# EAGLE design Grove - MOSFET (EAGLE 6.3)
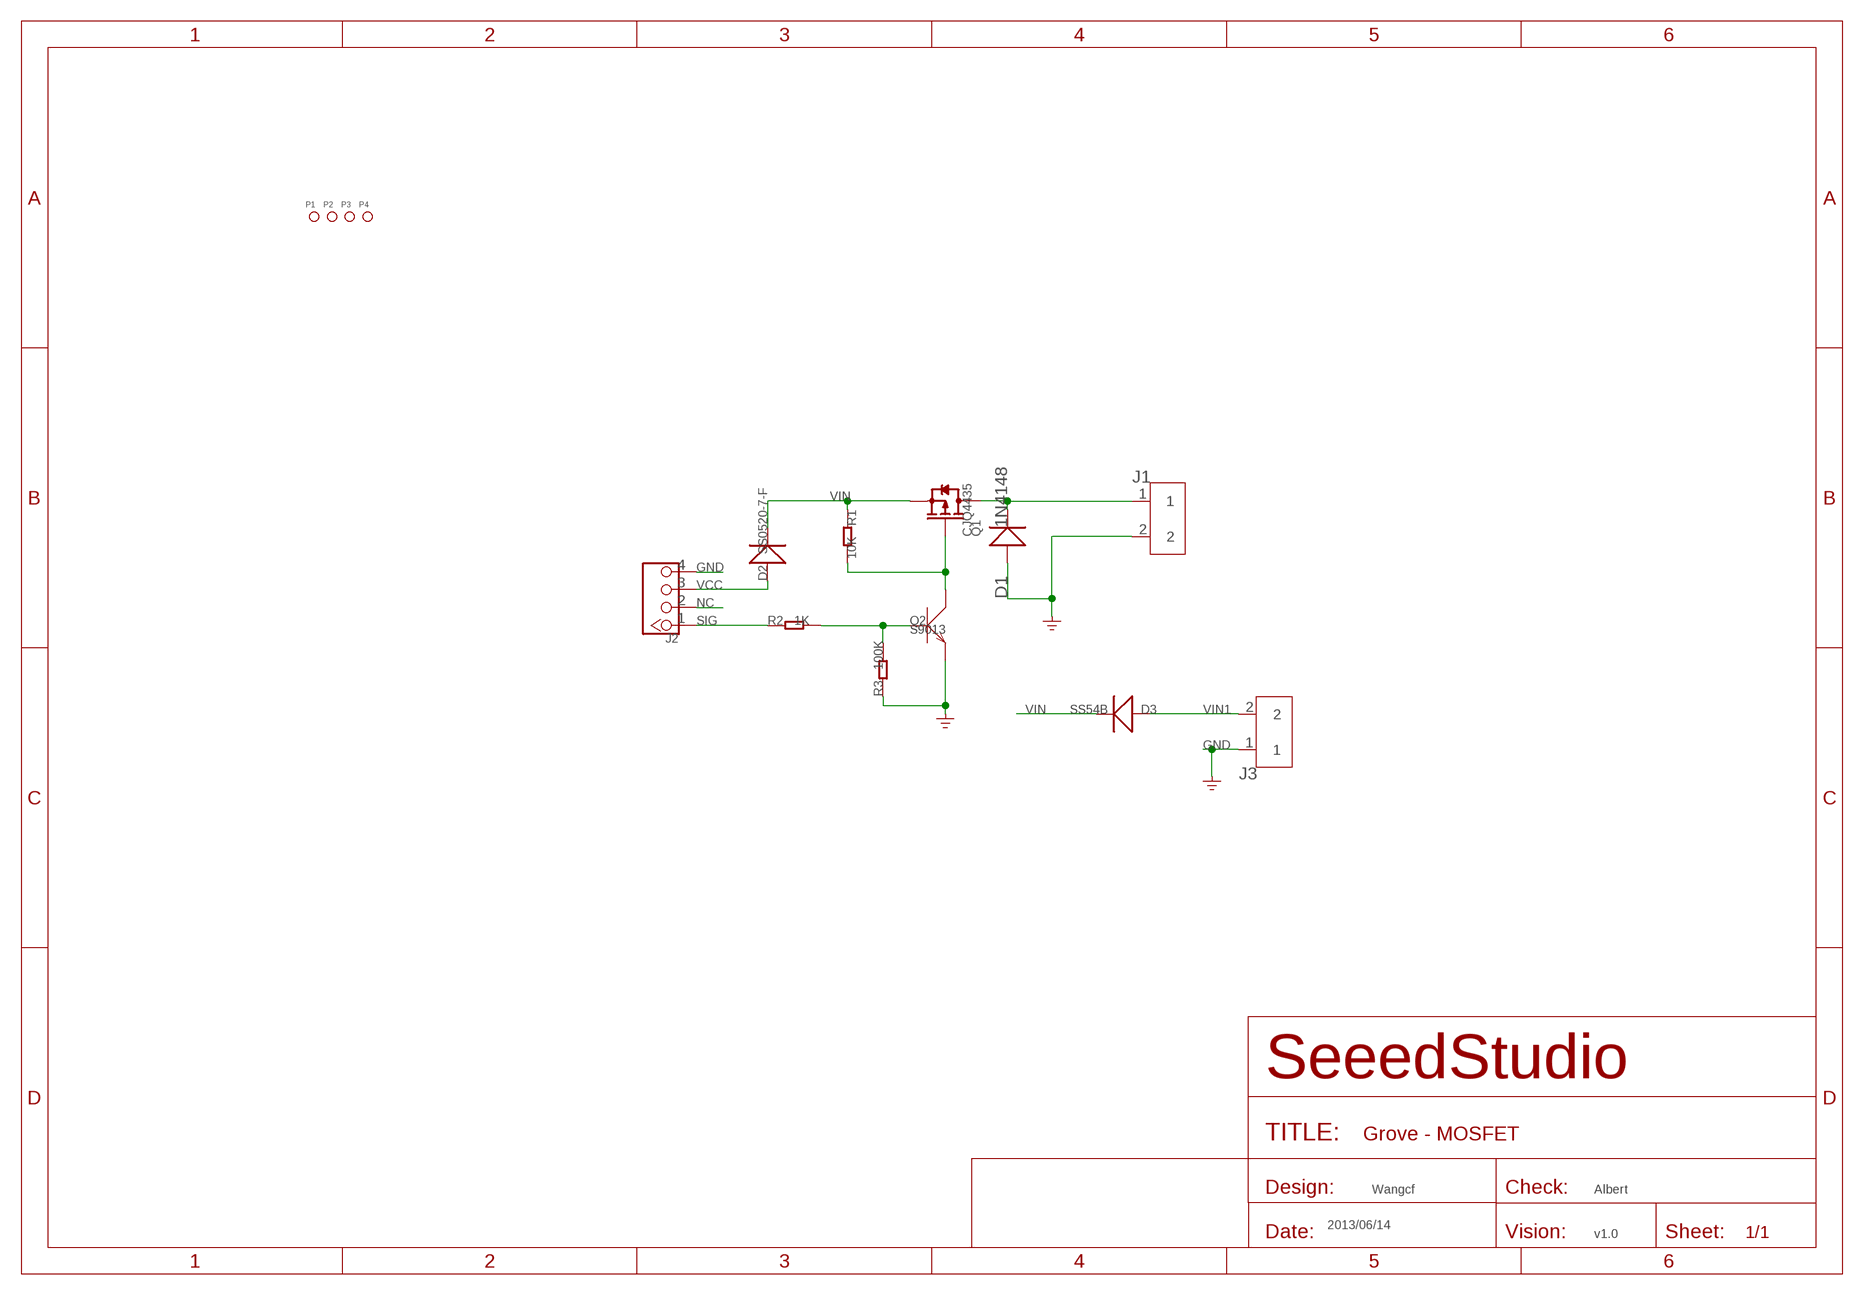
[diagram p0: schematic, sheet 1]

## Parts
D1  1N4148  D'1N4148-SMD'  [DO-35-SMD]
D2  SS0520-7-F  D'1206'  [SOD123]
D3  SS54B  D'MBRS240LT3'  [SMB]
J1  SCREW-TERMINAL-2P'5.0-10.6X10X14.8H'  [2P-5.0-10.6X10X14.8H]
J2  TWIG-4P-2.0-2.0  [4P-2.0]
J3  SCREW-TERMINAL-2P'5.0-10.6X10X14.8H'  [2P-5.0-10.6X10X14.8H]
P1  PAD-MARK  [ROUND-MARK-1.0]
P2  PAD-MARK  [ROUND-MARK-1.0]
P3  PAD-MARK  [ROUND-MARK-1.0]
P4  PAD-MARK  [ROUND-MARK-1.0]
Q1  CJQ4435  MOSFET-P'TPC8127'  [SOP8]
Q2  S9013  TRANSISTOR-NPN-SOT23  [SOT23]
R1  10K  R-0603  [R0603]
R2  1K  R-0603  [R0603]
R3  100K  R-0603  [R0603]

## Nets
GND: D1.A(+) J1.2 J2.4 J3.1 Q2.2(E) R3.1
N$1: Q2.1(B) R2.2 R3.2
N$3: D1.C(-) J1.1 Q1.5(D) Q1.6(D) Q1.7(D) Q1.8(D)
N$6: Q1.4(G) Q2.3(C) R1.2
NC: J2.2
SIG: J2.1 R2.1
VCC: D2.+ J2.3
VIN: D2.- D3.- Q1.1(S) Q1.2(S) Q1.3(S) R1.1
VIN1: D3.+ J3.2

## Notes on the sheet
- Wangcf | Albert
- 2013/06/14
- v1.0

## Library data of the parts
D1 D3 = Discrete:D*
D2 = Discrete1:D*
J1 J3 = Connector:SCREW-TERMINAL-2P
J2 = Connector:TWIG-4P-2.0
P1-P4 = Discrete:PAD-MARK; PARTNO: DNP
Q1 = Discrete1:MOSFET-P
Q2 = Discrete:TRANSISTOR-NPN*: NPN audion
R1-R3 = Discrete:R*

## Net classes
0 default: width 0.203 mm, drill 0.305 mm, clearance 0.203 mm

## Board
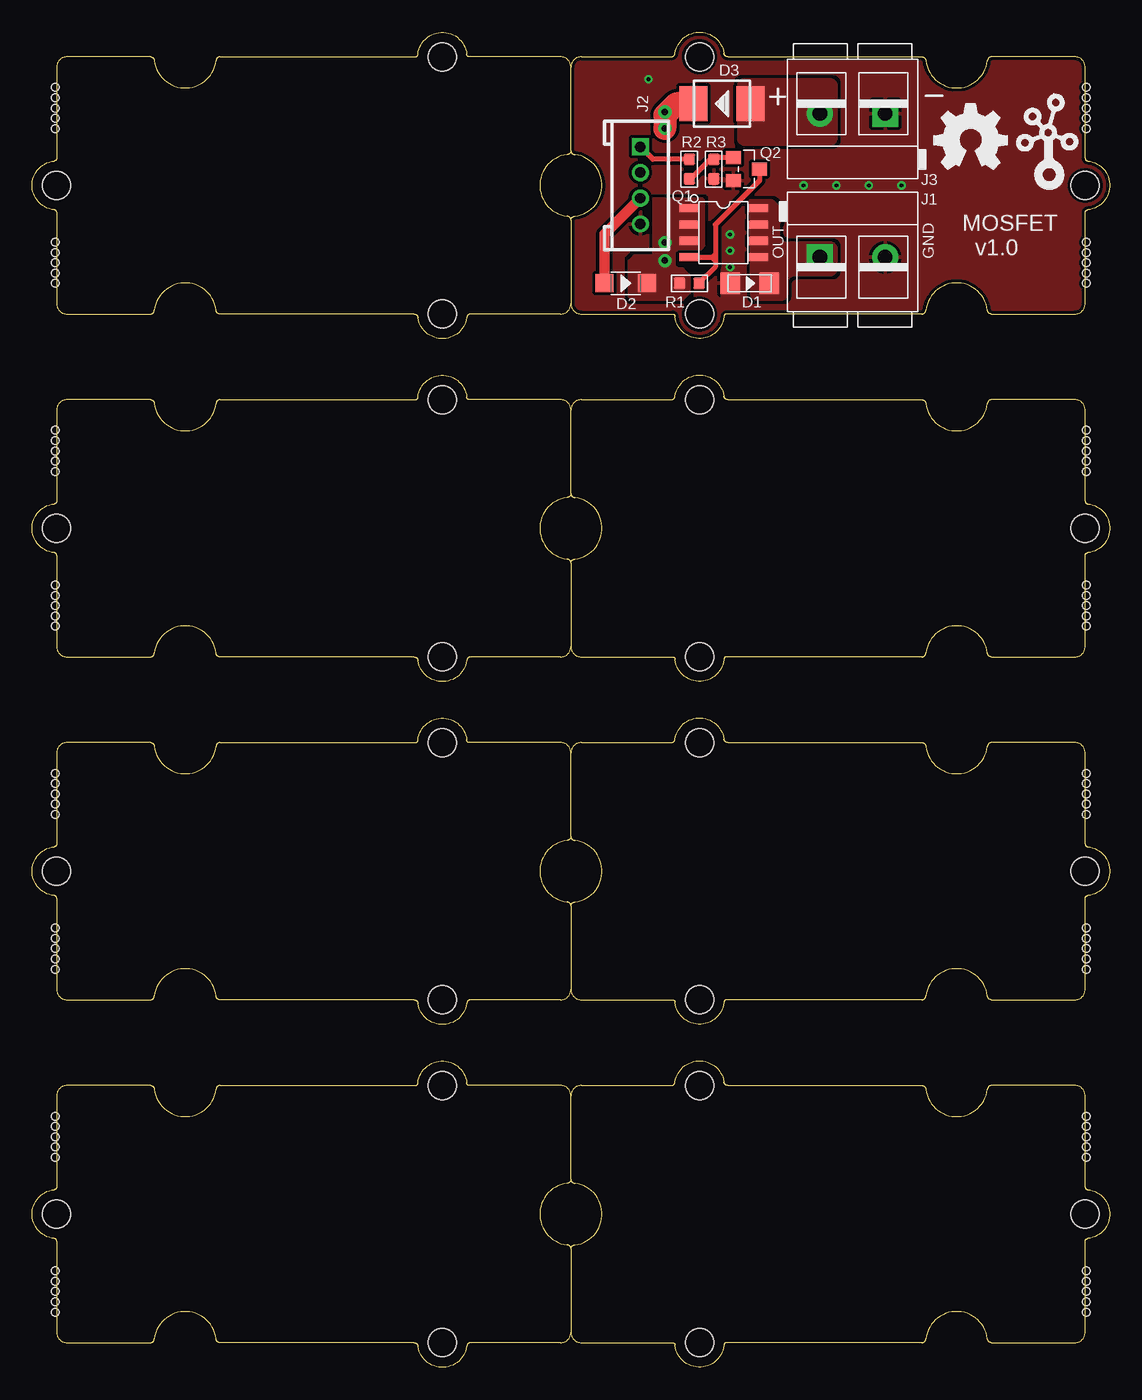
[diagram p1: board, top side]
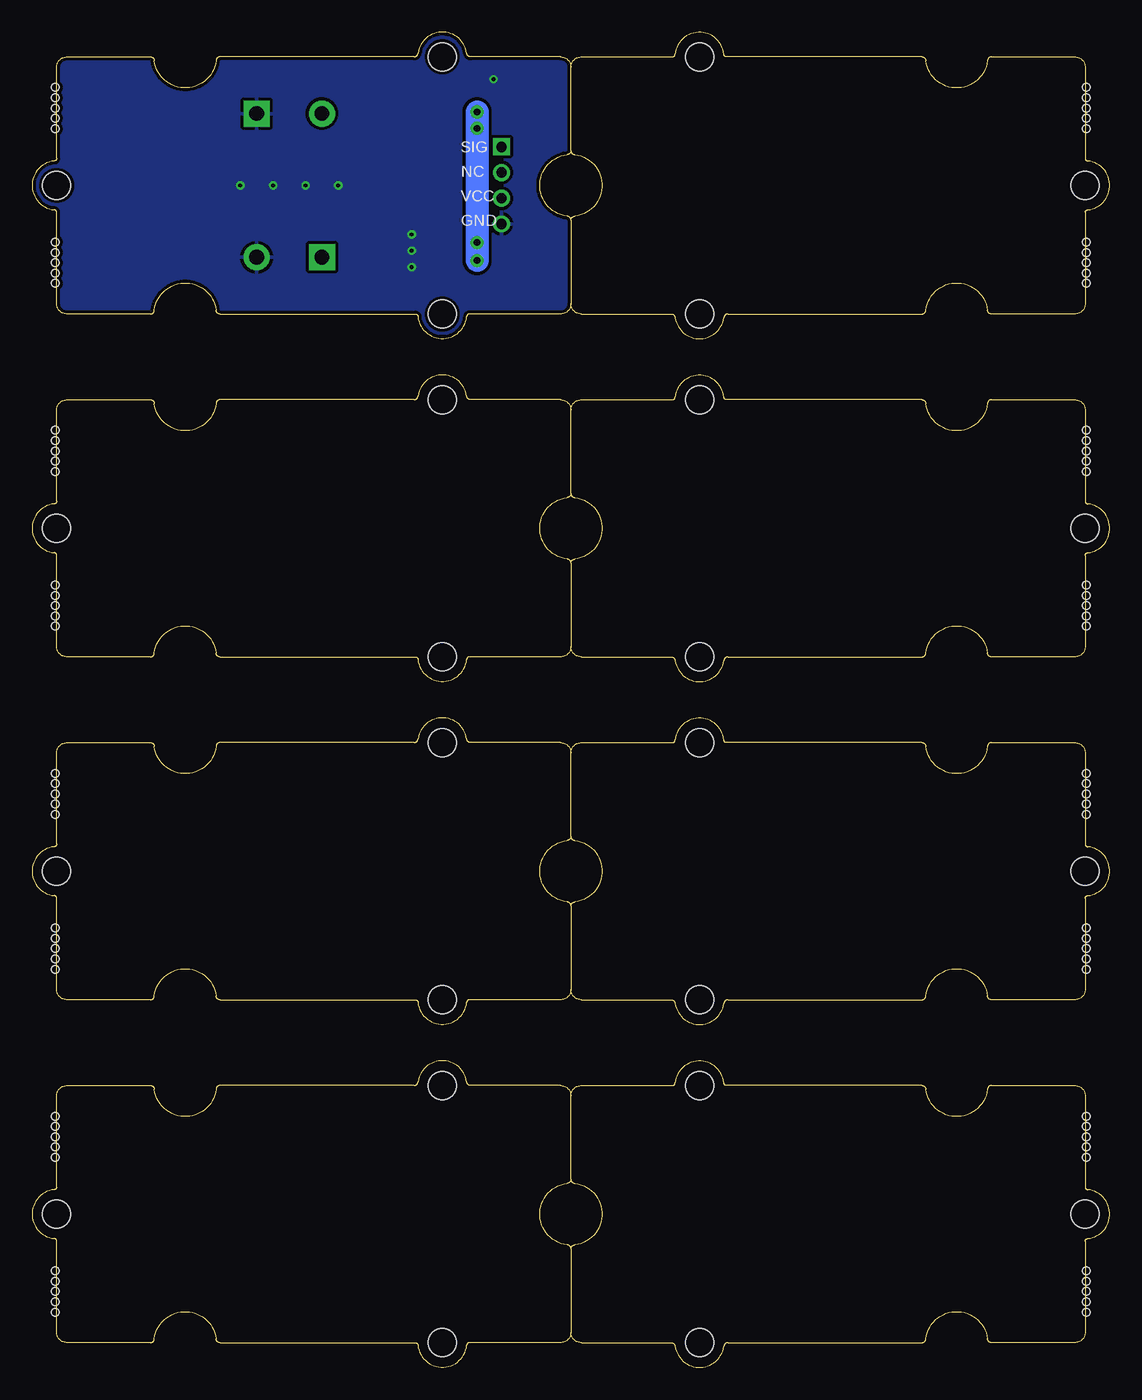
[diagram p2: board, bottom side, seen from below]

Size 83.82 x 103.85 mm. Coordinates in mm from the lower left corner, seen from the top.
Copper layers (1*16): Top 0.035mm / dielectric 1.5mm / Bottom 0.035mm
Design rules "SeeedStudio_DRU_no_angle_20130527 *": minimum track width 6mil, minimum drill 12mil, track to track 6mil, track to pad 6mil, pad to pad 6mil, via to via 6mil, smd to smd 0mil, copper to edge 10mil, drill to drill 10mil, minimum pad ring 10mil, minimum via ring 6mil, stop-mask expansion 2mil, vias tented up to drill 25mil, thermal gap 10mil
Holes 2.03 mm at -4.76,100.19 -4.76,3.67 88.58,3.67 88.58,100.19
Holes 0.6 mm at 1.81,99.55 1.81,98.75 1.81,97.95 1.81,97.15 1.81,96.35 1.81,84.31 1.81,85.11 1.81,85.91 1.81,86.71 1.81,87.51 1.81,72.88 1.81,72.08 1.81,71.28 1.81,70.48 1.81,69.68 1.81,57.64 1.81,58.44 1.81,59.24 1.81,60.04 1.81,60.84 1.81,46.21 1.81,45.41 1.81,44.61 1.81,43.81 1.81,43.01 1.81,30.97 1.81,31.77 1.81,32.57 1.81,33.37 1.81,34.17 1.81,19.54 1.81,18.74 1.81,17.94 1.81,17.14 1.81,16.34 1.81,4.3 1.81,5.1 1.81,5.9 1.81,6.7 1.81,7.5 82.01,4.3 82.01,5.1 82.01,5.9 82.01,6.7 82.01,7.5 82.01,19.54 82.01,18.74 82.01,17.94 82.01,17.14 82.01,16.34 82.01,30.97 82.01,31.77 82.01,32.57 82.01,33.37 82.01,34.17 82.01,46.21 82.01,45.41 82.01,44.61 82.01,43.81 82.01,43.01 82.01,57.64 82.01,58.44 82.01,59.24 82.01,60.04 82.01,60.84 82.01,72.88 82.01,72.08 82.01,71.28 82.01,70.48 82.01,69.68 82.01,84.31 82.01,85.11 82.01,85.91 82.01,86.71 82.01,87.51 82.01,99.55 82.01,98.75 82.01,97.95 82.01,97.15 82.01,96.35

### Footprints (pad centres in the part's own frame; a part is rotated, then mirrored left to right if it is on the bottom)
DO-35-SMD = smd 1.524 x 1.676: A -1.524,0; C 1.524,0
SOD123 = smd 1.397 x 1.397: + -1.651,0; - 1.651,0
SMB = smd 2.159 x 2.743: + -2.21,0; - 2.21,0
2P-5.0-10.6X10X14.8H = drill 1.143 pad 2.032 square: 1 -2.54,-0.508 | drill 1.143 pad 2.032: 2 2.54,-0.508
4P-2.0 = drill 0.8 pad 1.27 square: 1 -3,0 | drill 0.8 pad 1.27: 2 -1,0; 3 1,0; 4 3,0
ROUND-MARK-1.0 = smd 1.016 x 1.016: P$1 0,0
SOP8 = smd 0.635 x 1.524: 1 -1.905,-2.667; 2 -0.635,-2.667; 3 0.635,-2.667; 4 1.905,-2.667; 5 1.905,2.667; 6 0.635,2.667; 7 -0.635,2.667; 8 -1.905,2.667
SOT23 = smd 1.016 x 1.143: 1 -0.889,-1.016; 2 0.889,-1.016; 3 0,1.016
R0603 = smd 0.889 x 0.889: 1 -0.762,0; 2 0.762,0
2U-DIM-W/DRILL = hole 2.2: -10,-10; -10,10; 20,0

### Placement (x,y rotation side)
D1  55.82,84.31 0 top
D2  46.17,84.31 0 top
D3  53.66,98.28 180 top
J1  63.82,86.85 0 top
J2  47.31,91.93 270 top
J3  63.82,97.01 180 top
P1  -4.76,95.11 0 top  (outside the outline)
P2  88.58,95.11 0 top  (outside the outline)
P3  -4.76,8.75 0 top  (outside the outline)
P4  88.58,8.75 0 top  (outside the outline)
Q1  53.79,88.25 270 top
Q2  55.56,93.2 270 top
R1  51.12,84.31 0 top
R2  51.12,93.2 270 top
R3  53.02,93.2 90 top
U$5  [2U-DIM-W/DRILL]  61.91,91.93 0 top
U$6  [TWIGLOGO]  79.06,92.57 0 top
U$7  [OSHW_FILLX200_NOTEXT]  70.17,93.2 0 top
U$8  [2U-DIM-W/DRILL]  21.91,91.93 180 top
U$9  [2U-DIM-W/DRILL]  21.91,65.26 180 top
U$10  [2U-DIM-W/DRILL]  61.91,65.26 0 top
U$11  [2U-DIM-W/DRILL]  21.91,38.59 180 top
U$12  [2U-DIM-W/DRILL]  61.91,38.59 0 top
U$13  [2U-DIM-W/DRILL]  21.91,11.92 180 top
U$14  [2U-DIM-W/DRILL]  61.91,11.92 0 top

### Tracks (layer width: path | path; a pad name or v marks a point on that pad's centre or on a via)
GND  (via drill 0.3 pad 0.64)
  other vias: 47.94,100.19 54.29,88.12 60.01,91.93 62.55,91.93 65.09,91.93 67.63,91.93 54.29,86.85 54.29,85.58
  pour Bottom (isolate 0.254, rank 3): 41.59,79.87 84.14,79.87 84.14,104 41.59,104
  pour Top (isolate 0.254, rank 3): 41.59,79.87 84.14,79.87 84.14,102.09 84.14,104 41.59,104 41.59,79.99
  pour Top (isolate 0.254, no thermals): 53.66,85.58 55.44,85.58 55.44,82.66 53.66,82.66
N$1
  Top 0.406: R2.2 51.25,92.44 52.77,93.96 R3.2 | R3.2 53.15,94.09 | Q2.1 53.02,94.09 R3.2
N$3
  pour Top (isolate 0.254, no thermals): 55.82,90.79 55.94,83.55 arc90 56.45,83.04 58.23,83.04 arc90 58.74,83.55 58.74,84.44 arc-90 59.25,84.95 62.04,84.95 arc90 62.55,85.45 62.55,86.98 arc90 62.04,87.49 58.61,87.49 arc-90 58.1,87.99 58.1,89.01 arc90 57.47,90.79
N$6
  Top 0.406: 51.75,84.31 R1.2 53.15,85.58 53.15,86.09 | Q2.3 56.58,92.31 53.15,88.88 53.15,86.6 | 53.15,86.6 53.15,86.34 | 53.15,86.34 53.15,86.09 | Q1.4 52.77,86.34 52.9,86.34 | 52.9,86.34 53.15,86.34 | 52.9,86.34 53.15,86.6 | 52.9,86.34 53.15,86.09
SIG
  Top 0.406: R2.1 48.28,93.96 J2.1
VCC
  Top 0.813: D2.+ 44.51,88.14 J2.3
VIN  (via drill 0.51 pad 1.02)
  Top 0.203: 49.21,97.38 v49.21,97.65
  Top 1.778: D3.- 50.11,98.28 49.21,97.38 v49.21,96.38
  Bottom 1.778: v49.21,97.65 v49.21,86.09
  other vias: 49.21,87.49
  pour Top (no thermals): 48.32,90.92 48.32,86.47 46.8,86.47 46.42,86.09 46.42,83.3 46.67,83.04 50.61,83.04 51.12,83.55 51.12,84.95 50.61,85.45 50.23,85.45 49.98,85.71 49.98,86.72 50.23,86.98 52.01,86.98 52.26,87.23 52.26,90.79 52.13,90.92
VIN1
  pour Top (isolate 0.254, no thermals): 55.44,100.19 62.04,100.19 arc-90 62.55,99.68 62.55,95.61 arc-90 62.04,95.11 55.44,95.11 arc-90 54.93,95.61 54.93,99.68 arc-90

### Text on the board
tPlace: + | MOSFET / v1.0 | OUT | GND
bPlace: SIG | NC | VCC | GND